# Altium schematic sheet PROB_S7CAS_DDR.SchDoc
size Tabloid; SheetNumber: 10; SheetTotal: 15; Sheet_Name: RAM DDR3 FPGA; Size: 11x17
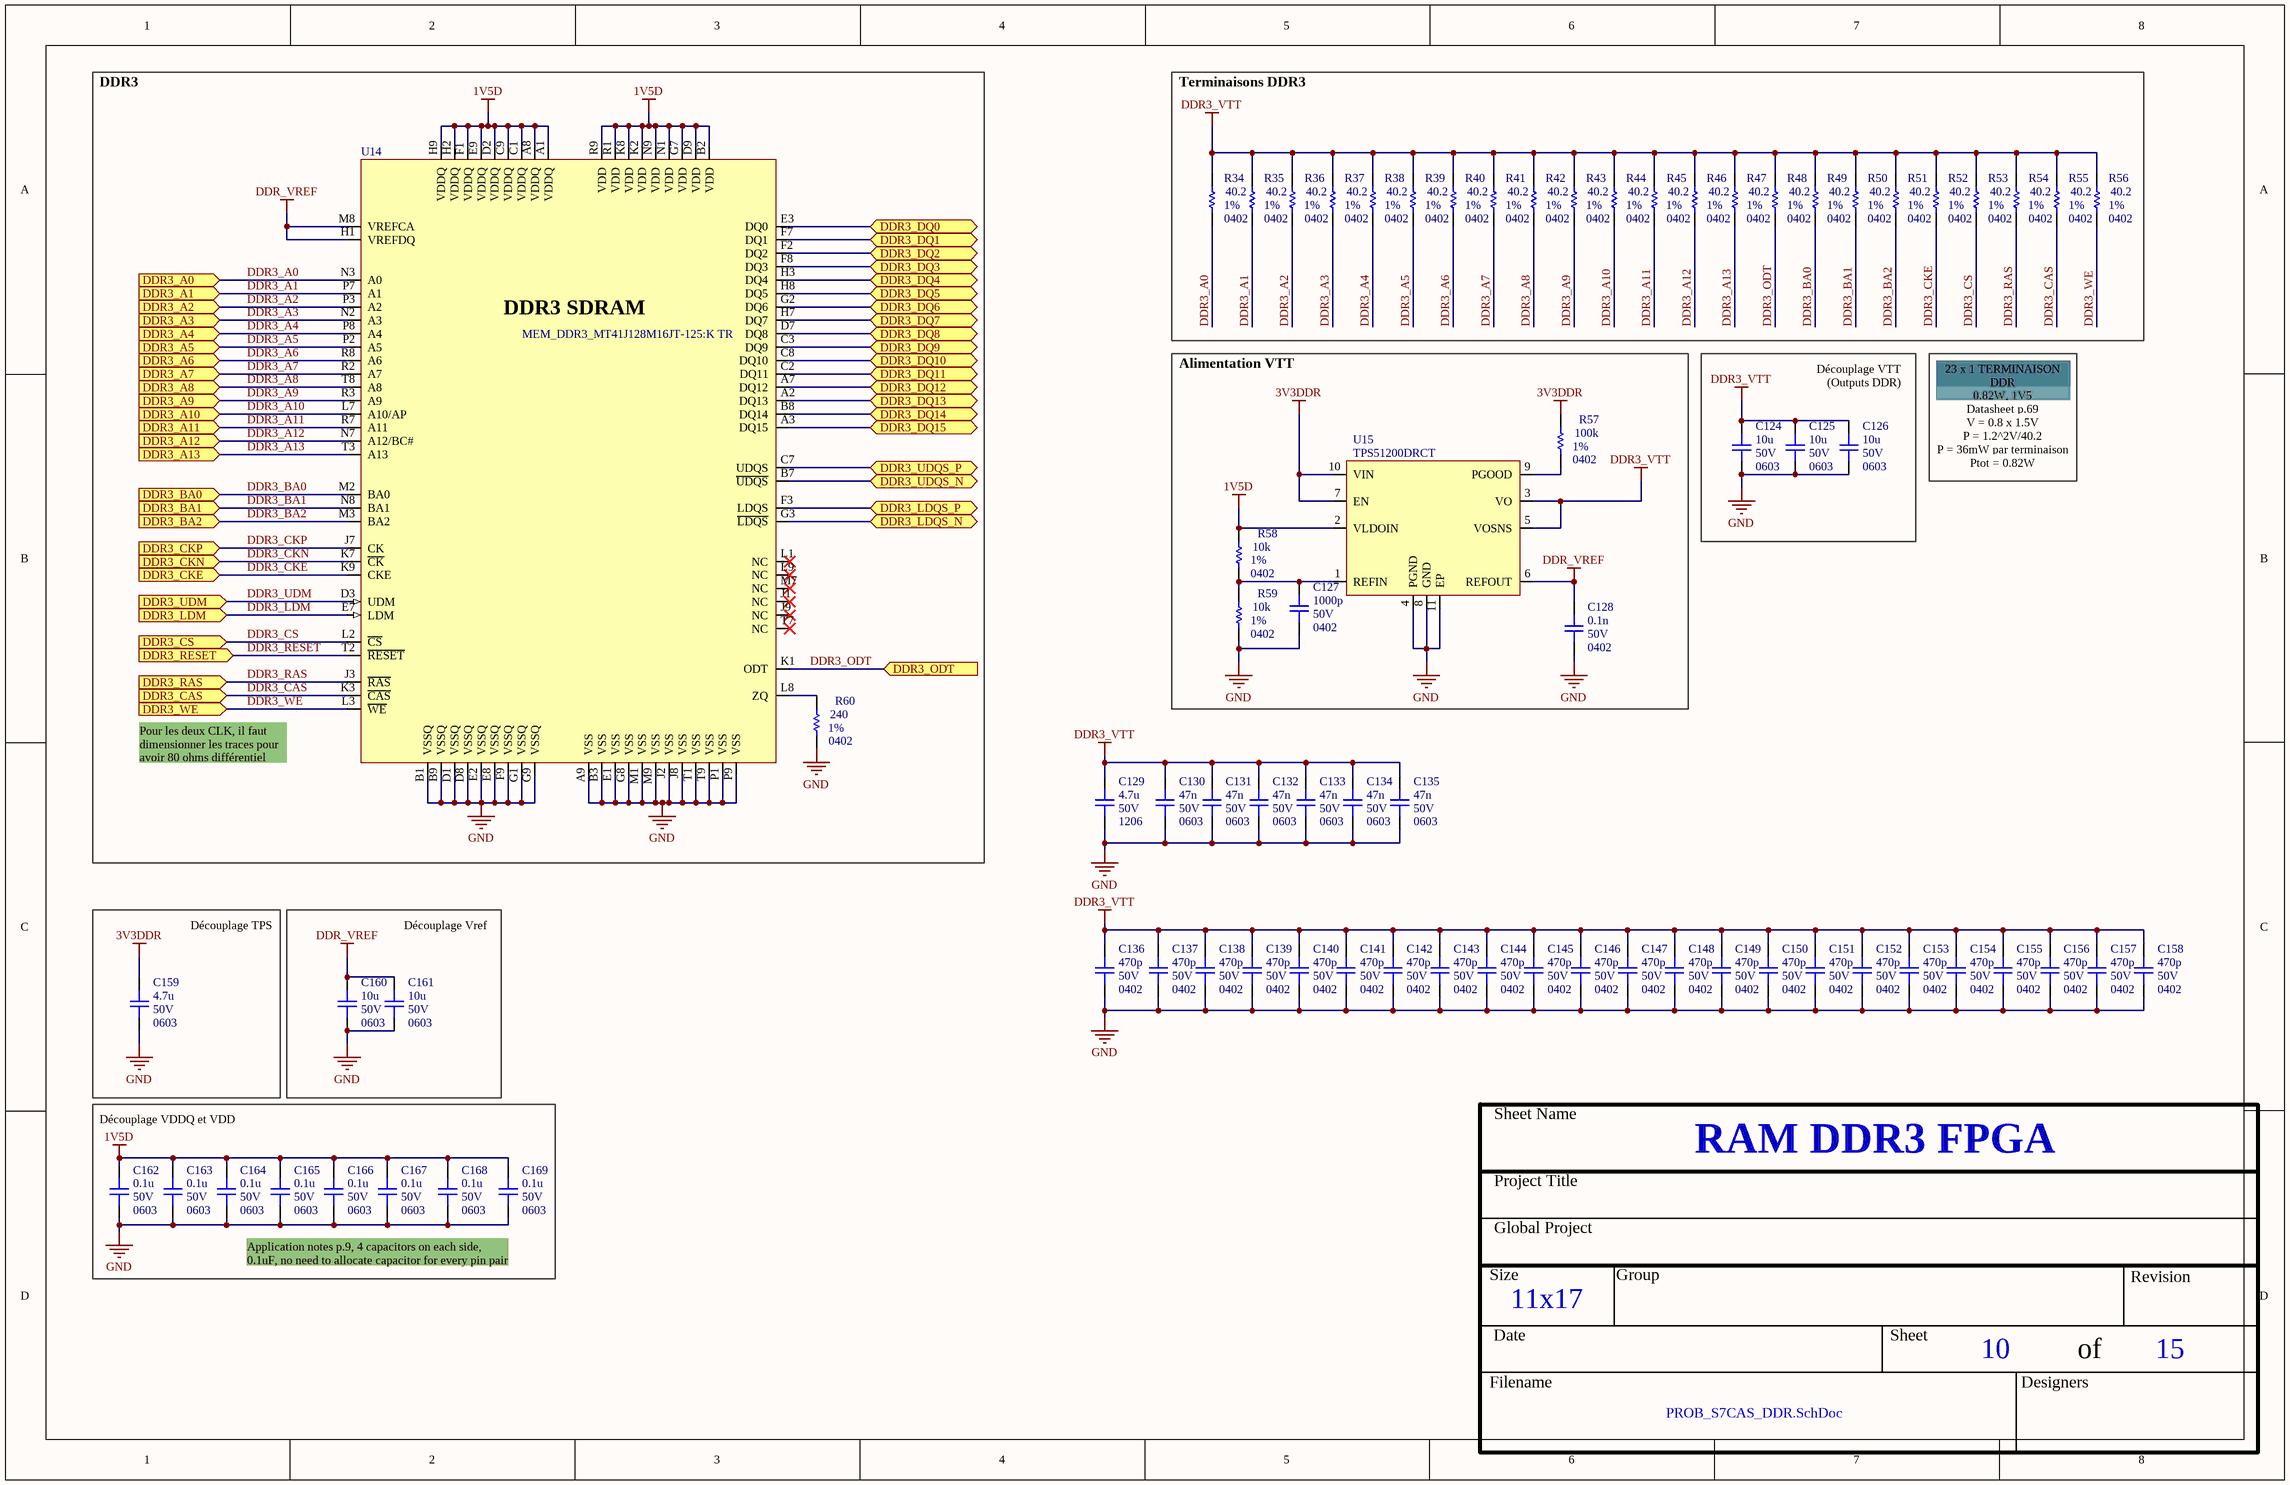
[diagram p0: PROB_S7CAS_DDR.SchDoc]

## Parts
C124  value 10u  Voltage: 50V  Package: 0603  [CAP_0603]  (hidden comment: CAP - 0603)
C125  value 10u  Voltage: 50V  Package: 0603  [CAP_0603]  (hidden comment: CAP - 0603)
C126  value 10u  Voltage: 50V  Package: 0603  [CAP_0603]  (hidden comment: CAP - 0603)
C127  value 1000p  Voltage: 50V  Package: 0402  [CAP_0402]  (hidden comment: CAP - 0402)
C128  value 0.1n  Voltage: 50V  Package: 0402  [CAP_0402]  (hidden comment: CAP - 0402)
C129  value 4.7u  Voltage: 50V  Package: 1206  [CAP_1206]  (hidden comment: CAP - 1206)
C130  value 47n  Voltage: 50V  Package: 0603  [CAP_0603]  (hidden comment: CAP - 0603)
C131  value 47n  Voltage: 50V  Package: 0603  [CAP_0603]  (hidden comment: CAP - 0603)
C132  value 47n  Voltage: 50V  Package: 0603  [CAP_0603]  (hidden comment: CAP - 0603)
C133  value 47n  Voltage: 50V  Package: 0603  [CAP_0603]  (hidden comment: CAP - 0603)
C134  value 47n  Voltage: 50V  Package: 0603  [CAP_0603]  (hidden comment: CAP - 0603)
C135  value 47n  Voltage: 50V  Package: 0603  [CAP_0603]  (hidden comment: CAP - 0603)
C136  value 470p  Voltage: 50V  Package: 0402  [CAP_0402]  (hidden comment: CAP - 0402)
C137  value 470p  Voltage: 50V  Package: 0402  [CAP_0402]  (hidden comment: CAP - 0402)
C138  value 470p  Voltage: 50V  Package: 0402  [CAP_0402]  (hidden comment: CAP - 0402)
C139  value 470p  Voltage: 50V  Package: 0402  [CAP_0402]  (hidden comment: CAP - 0402)
C140  value 470p  Voltage: 50V  Package: 0402  [CAP_0402]  (hidden comment: CAP - 0402)
C141  value 470p  Voltage: 50V  Package: 0402  [CAP_0402]  (hidden comment: CAP - 0402)
C142  value 470p  Voltage: 50V  Package: 0402  [CAP_0402]  (hidden comment: CAP - 0402)
C143  value 470p  Voltage: 50V  Package: 0402  [CAP_0402]  (hidden comment: CAP - 0402)
C144  value 470p  Voltage: 50V  Package: 0402  [CAP_0402]  (hidden comment: CAP - 0402)
C145  value 470p  Voltage: 50V  Package: 0402  [CAP_0402]  (hidden comment: CAP - 0402)
C146  value 470p  Voltage: 50V  Package: 0402  [CAP_0402]  (hidden comment: CAP - 0402)
C147  value 470p  Voltage: 50V  Package: 0402  [CAP_0402]  (hidden comment: CAP - 0402)
C148  value 470p  Voltage: 50V  Package: 0402  [CAP_0402]  (hidden comment: CAP - 0402)
C149  value 470p  Voltage: 50V  Package: 0402  [CAP_0402]  (hidden comment: CAP - 0402)
C150  value 470p  Voltage: 50V  Package: 0402  [CAP_0402]  (hidden comment: CAP - 0402)
C151  value 470p  Voltage: 50V  Package: 0402  [CAP_0402]  (hidden comment: CAP - 0402)
C152  value 470p  Voltage: 50V  Package: 0402  [CAP_0402]  (hidden comment: CAP - 0402)
C153  value 470p  Voltage: 50V  Package: 0402  [CAP_0402]  (hidden comment: CAP - 0402)
C154  value 470p  Voltage: 50V  Package: 0402  [CAP_0402]  (hidden comment: CAP - 0402)
C155  value 470p  Voltage: 50V  Package: 0402  [CAP_0402]  (hidden comment: CAP - 0402)
C156  value 470p  Voltage: 50V  Package: 0402  [CAP_0402]  (hidden comment: CAP - 0402)
C157  value 470p  Voltage: 50V  Package: 0402  [CAP_0402]  (hidden comment: CAP - 0402)
C158  value 470p  Voltage: 50V  Package: 0402  [CAP_0402]  (hidden comment: CAP - 0402)
C159  value 4.7u  Voltage: 50V  Package: 0603  [CAP_0603]  (hidden comment: CAP - 0603)
C160  value 10u  Voltage: 50V  Package: 0603  [CAP_0603]  (hidden comment: CAP - 0603)
C161  value 10u  Voltage: 50V  Package: 0603  [CAP_0603]  (hidden comment: CAP - 0603)
C162  value 0.1u  Voltage: 50V  Package: 0603  [CAP_0603]  (hidden comment: CAP - 0603)
C163  value 0.1u  Voltage: 50V  Package: 0603  [CAP_0603]  (hidden comment: CAP - 0603)
C164  value 0.1u  Voltage: 50V  Package: 0603  [CAP_0603]  (hidden comment: CAP - 0603)
C165  value 0.1u  Voltage: 50V  Package: 0603  [CAP_0603]  (hidden comment: CAP - 0603)
C166  value 0.1u  Voltage: 50V  Package: 0603  [CAP_0603]  (hidden comment: CAP - 0603)
C167  value 0.1u  Voltage: 50V  Package: 0603  [CAP_0603]  (hidden comment: CAP - 0603)
C168  value 0.1u  Voltage: 50V  Package: 0603  [CAP_0603]  (hidden comment: CAP - 0603)
C169  value 0.1u  Voltage: 50V  Package: 0603  [CAP_0603]  (hidden comment: CAP - 0603)
R34  value 40.2  Package: 0402  Precision: 1%  [RES_0402]  (hidden comment: RES - 0402)
R35  value 40.2  Package: 0402  Precision: 1%  [RES_0402]  (hidden comment: RES - 0402)
R36  value 40.2  Package: 0402  Precision: 1%  [RES_0402]  (hidden comment: RES - 0402)
R37  value 40.2  Package: 0402  Precision: 1%  [RES_0402]  (hidden comment: RES - 0402)
R38  value 40.2  Package: 0402  Precision: 1%  [RES_0402]  (hidden comment: RES - 0402)
R39  value 40.2  Package: 0402  Precision: 1%  [RES_0402]  (hidden comment: RES - 0402)
R40  value 40.2  Package: 0402  Precision: 1%  [RES_0402]  (hidden comment: RES - 0402)
R41  value 40.2  Package: 0402  Precision: 1%  [RES_0402]  (hidden comment: RES - 0402)
R42  value 40.2  Package: 0402  Precision: 1%  [RES_0402]  (hidden comment: RES - 0402)
R43  value 40.2  Package: 0402  Precision: 1%  [RES_0402]  (hidden comment: RES - 0402)
R44  value 40.2  Package: 0402  Precision: 1%  [RES_0402]  (hidden comment: RES - 0402)
R45  value 40.2  Package: 0402  Precision: 1%  [RES_0402]  (hidden comment: RES - 0402)
R46  value 40.2  Package: 0402  Precision: 1%  [RES_0402]  (hidden comment: RES - 0402)
R47  value 40.2  Package: 0402  Precision: 1%  [RES_0402]  (hidden comment: RES - 0402)
R48  value 40.2  Package: 0402  Precision: 1%  [RES_0402]  (hidden comment: RES - 0402)
R49  value 40.2  Package: 0402  Precision: 1%  [RES_0402]  (hidden comment: RES - 0402)
R50  value 40.2  Package: 0402  Precision: 1%  [RES_0402]  (hidden comment: RES - 0402)
R51  value 40.2  Package: 0402  Precision: 1%  [RES_0402]  (hidden comment: RES - 0402)
R52  value 40.2  Package: 0402  Precision: 1%  [RES_0402]  (hidden comment: RES - 0402)
R53  value 40.2  Package: 0402  Precision: 1%  [RES_0402]  (hidden comment: RES - 0402)
R54  value 40.2  Package: 0402  Precision: 1%  [RES_0402]  (hidden comment: RES - 0402)
R55  value 40.2  Package: 0402  Precision: 1%  [RES_0402]  (hidden comment: RES - 0402)
R56  value 40.2  Package: 0402  Precision: 1%  [RES_0402]  (hidden comment: RES - 0402)
R57  value 100k  Package: 0402  Precision: 1%  [RES_0402]  (hidden comment: RES - 0402)
R58  value 10k  Package: 0402  Precision: 1%  [RES_0402]  (hidden comment: RES - 0402)
R59  value 10k  Package: 0402  Precision: 1%  [RES_0402]  (hidden comment: RES - 0402)
R60  value 240  Package: 0402  Precision: 1%  [RES_0402]  (hidden comment: RES - 0402)
U14  MEM_DDR3_MT41J128M16JT-125:K TR  [MEM_DDR3_MT41J128M16JT-125]
U15  TPS51200DRCT  [REG_PMIC_TPS51200DRCT]

## Ports
DDR3_A0 (in), DDR3_A1 (in), DDR3_A2 (in), DDR3_A3 (in), DDR3_A4 (in), DDR3_A5 (in), DDR3_A6 (in), DDR3_A7 (in), DDR3_A8 (in), DDR3_A9 (in), DDR3_A10 (in), DDR3_A11 (in), DDR3_A12 (in), DDR3_A13 (in), DDR3_BA0 (in), DDR3_BA1 (in), DDR3_BA2 (in), DDR3_CAS (in), DDR3_CKE (in), DDR3_CKN (in), DDR3_CKP (in), DDR3_CS (in), DDR3_DQ0 (bidir), DDR3_DQ1 (bidir), DDR3_DQ2 (bidir), DDR3_DQ3 (bidir), DDR3_DQ4 (bidir), DDR3_DQ5 (bidir), DDR3_DQ6 (bidir), DDR3_DQ7 (bidir), DDR3_DQ8 (bidir), DDR3_DQ9 (bidir), DDR3_DQ10 (bidir), DDR3_DQ11 (bidir), DDR3_DQ12 (bidir), DDR3_DQ13 (bidir), DDR3_DQ14 (bidir), DDR3_DQ15 (bidir), DDR3_LDM (in), DDR3_LDQS_N (bidir), DDR3_LDQS_P (bidir), DDR3_ODT (in), DDR3_RAS (in), DDR3_RESET (in), DDR3_UDM (in), DDR3_UDQS_N (bidir), DDR3_UDQS_P (bidir), DDR3_WE (in)

## Nets
1V5D: C162.2 C163.2 C164.2 C165.2 C166.2 C167.2 C168.2 C169.2 R58.2 U14.A1(VDDQ) U14.A8(VDDQ) U14.B2(VDD) U14.C1(VDDQ) U14.C9(VDDQ) U14.D2(VDDQ) U14.D9(VDD) U14.E9(VDDQ) U14.F1(VDDQ) U14.G7(VDD) U14.H2(VDDQ) U14.H9(VDDQ) U14.K2(VDD) U14.K8(VDD) U14.N1(VDD) U14.N9(VDD) U14.R1(VDD) U14.R9(VDD) U15.2(VLDOIN)
3V3DDR: C159.2 R57.2 U15.7(EN) U15.10(VIN)
DDR3_VTT: C124.2 C125.2 C126.2 C129.2 C130.2 C131.2 C132.2 C133.2 C134.2 C135.2 C136.2 C137.2 C138.2 C139.2 C140.2 C141.2 C142.2 C143.2 C144.2 C145.2 C146.2 C147.2 C148.2 C149.2 C150.2 C151.2 C152.2 C153.2 C154.2 C155.2 C156.2 C157.2 C158.2 R34.2 R35.2 R36.2 R37.2 R38.2 R39.2 R40.2 R41.2 R42.2 R43.2 R44.2 R45.2 R46.2 R47.2 R48.2 R49.2 R50.2 R51.2 R52.2 R53.2 R54.2 R55.2 R56.2 U15.3(VO) U15.5(VOSNS)
DDR_VREF: C128.2 C160.2 C161.2 U14.H1(VREFDQ) U14.M8(VREFCA) U15.6(REFOUT)
GND: C124.1 C125.1 C126.1 C127.1 C128.1 C129.1 C130.1 C131.1 C132.1 C133.1 C134.1 C135.1 C136.1 C137.1 C138.1 C139.1 C140.1 C141.1 C142.1 C143.1 C144.1 C145.1 C146.1 C147.1 C148.1 C149.1 C150.1 C151.1 C152.1 C153.1 C154.1 C155.1 C156.1 C157.1 C158.1 C159.1 C160.1 C161.1 C162.1 C163.1 C164.1 C165.1 C166.1 C167.1 C168.1 C169.1 R59.1 R60.1 U14.A9(VSS) U14.B1(VSSQ) U14.B3(VSS) U14.B9(VSSQ) U14.D1(VSSQ) U14.D8(VSSQ) U14.E1(VSS) U14.E2(VSSQ) U14.E8(VSSQ) U14.F9(VSSQ) U14.G1(VSSQ) U14.G8(VSS) U14.G9(VSSQ) U14.J2(VSS) U14.J8(VSS) U14.M1(VSS) U14.M9(VSS) U14.P1(VSS) U14.P9(VSS) U14.T1(VSS) U14.T9(VSS) U15.4(PGND) U15.8(GND) U15.11(EP)
DDR3_A0: R34.1 U14.N3(A0) ; port DDR3_A0
DDR3_A1: R35.1 U14.P7(A1) ; port DDR3_A1
DDR3_A2: R36.1 U14.P3(A2) ; port DDR3_A2
DDR3_A3: R37.1 U14.N2(A3) ; port DDR3_A3
DDR3_A4: R38.1 U14.P8(A4) ; port DDR3_A4
DDR3_A5: R39.1 U14.P2(A5) ; port DDR3_A5
DDR3_A6: R40.1 U14.R8(A6) ; port DDR3_A6
DDR3_A7: R41.1 U14.R2(A7) ; port DDR3_A7
DDR3_A8: R42.1 U14.T8(A8) ; port DDR3_A8
DDR3_A9: R43.1 U14.R3(A9) ; port DDR3_A9
DDR3_A10: R44.1 U14.L7(A10/AP) ; port DDR3_A10
DDR3_A11: R45.1 U14.R7(A11) ; port DDR3_A11
DDR3_A12: R46.1 U14.N7(A12/BC#) ; port DDR3_A12
DDR3_A13: R47.1 U14.T3(A13) ; port DDR3_A13
DDR3_BA0: R49.1 U14.M2(BA0) ; port DDR3_BA0
DDR3_BA1: R50.1 U14.N8(BA1) ; port DDR3_BA1
DDR3_BA2: R51.1 U14.M3(BA2) ; port DDR3_BA2
DDR3_CAS: R55.1 U14.K3(~{CAS}) ; port DDR3_CAS
DDR3_CKE: R52.1 U14.K9(CKE) ; port DDR3_CKE
DDR3_CKN: U14.K7(~{CK}) ; port DDR3_CKN
DDR3_CKP: U14.J7(CK) ; port DDR3_CKP
DDR3_CS: R53.1 U14.L2(~{CS}) ; port DDR3_CS
DDR3_DQ0: U14.E3(DQ0) ; port DDR3_DQ0
DDR3_DQ1: U14.F7(DQ1) ; port DDR3_DQ1
DDR3_DQ2: U14.F2(DQ2) ; port DDR3_DQ2
DDR3_DQ3: U14.F8(DQ3) ; port DDR3_DQ3
DDR3_DQ4: U14.H3(DQ4) ; port DDR3_DQ4
DDR3_DQ5: U14.H8(DQ5) ; port DDR3_DQ5
DDR3_DQ6: U14.G2(DQ6) ; port DDR3_DQ6
DDR3_DQ7: U14.H7(DQ7) ; port DDR3_DQ7
DDR3_DQ8: U14.D7(DQ8) ; port DDR3_DQ8
DDR3_DQ9: U14.C3(DQ9) ; port DDR3_DQ9
DDR3_DQ10: U14.C8(DQ10) ; port DDR3_DQ10
DDR3_DQ11: U14.C2(DQ11) ; port DDR3_DQ11
DDR3_DQ12: U14.A7(DQ12) ; port DDR3_DQ12
DDR3_DQ13: U14.A2(DQ13) ; port DDR3_DQ13
DDR3_DQ14: U14.B8(DQ14) ; port DDR3_DQ14
DDR3_DQ15: U14.A3(DQ15) ; port DDR3_DQ15
DDR3_LDM: U14.E7(LDM) ; port DDR3_LDM
DDR3_LDQS_N: U14.G3(~{LDQS}) ; port DDR3_LDQS_N
DDR3_LDQS_P: U14.F3(LDQS) ; port DDR3_LDQS_P
DDR3_ODT: R48.1 U14.K1(ODT) ; port DDR3_ODT
DDR3_RAS: R54.1 U14.J3(~{RAS}) ; port DDR3_RAS
DDR3_RESET: U14.T2(~{RESET}) ; port DDR3_RESET
DDR3_UDM: U14.D3(UDM) ; port DDR3_UDM
DDR3_UDQS_N: U14.B7(~{UDQS}) ; port DDR3_UDQS_N
DDR3_UDQS_P: U14.C7(UDQS) ; port DDR3_UDQS_P
DDR3_WE: R56.1 U14.L3(~{WE}) ; port DDR3_WE
NetC127_2: C127.2 R58.1 R59.2 U15.1(REFIN)
NetR57_1: R57.1 U15.9(PGOOD)
NetR60_2: R60.2 U14.L8(ZQ)

Not connected (* = marked no-connect by the designer): U14 J1(NC)* J9(NC)* L1(NC)* L9(NC)* M7(NC)* T7(NC)*

## Notes on the sheet
- DDR3
- Terminaisons DDR3
- Alimentation VTT
- Découplage VTT (Outputs DDR)
- 23 x 1 TERMINAISON
- DDR
- 0.82W, 1V5
- Datasheet p.69
- V = 0.8 x 1.5V
- P = 1.2^2V/40.2
- P = 36mW par terminaison
- Ptot = 0.82W
- Pour les deux CLK, il faut dimensionner les traces pour avoir 80 ohms différentiel
- Découplage TPS
- Découplage Vref
- Découplage VDDQ et VDD
- Application notes p.9, 4 capacitors on each side, 0.1uF, no need to allocate capacitor for every pin pair
- Sheet Name
- Project Title
- Global Project
- Size
- Group
- Revision
- Date
- Sheet
- of
- Filename
- Designers
- (in symbol MEM_DDR3_MT41J128M16JT-125:K TR) DDR3 SDRAM

## Library data of the parts
C124-C126 C130-C135 C159-C169 = CAP - 0603: Precision: 10%; Current: *; CreatedBy: Jonathan Bouchard; Power: *
C127 C128 C136-C158 = CAP - 0402: Precision: 10%; Current: *; CreatedBy: Jonathan Bouchard; Power: *
C129 = CAP - 1206: Precision: 10%; Current: *; CreatedBy: Jonathan Bouchard; Power: *
R34-R60 = RES - 0402: Voltage: 50V; Power: 1/16W; Current: *; CreatedBy: Jonathan Bouchard
U14 = MEM_DDR3_MT41J128M16JT-125:K TR: MEM - DDR3 SDRAM 2GBIT 800MHZ - TFBGA-96; Voltage: 1.425 V ~ 1.575 V; Mfg: Micrel; Current: *; Package: TFBGA-96; Precision: *; Mfg Part Number: http://www.micron.com/~/media/Documents/Products/Data%20Sheet/DRAM/DDR3/2Gb_DDR3_SDRAM.pdf; Temperature: 0°C ~ 95°C (TC); Power: *; HelpURL: http://ww1.microchip.com/downloads/en/DeviceDoc/00002275A.pdf; CreatedBy: Jonathan Bouchard; Value: *; Supplier 1: Digikey; Supplier Part Number 1: 557-1611-1-ND
U15 = REG_PMIC_TPS51200DRCT: REG - DDR TERMINATION/REF REG - 10-VFDFN; Manufacturer #1: Texas Instruments; Value: DDR, DDR2, DDR3(L), DDR4; Voltage Rating: 2.375V ~ 3.5V; Current Rating: Source: 3A~4.5A, Sink: 3.5A~5.5A; GRAMS Lib Spec: 2.8; Magnetic Material: Unknown; Polarized: Yes; Tolerance: *; Power Max: *; HelpURL: http://www.ti.com/lit/ds/symlink/tps51200.pdf; CreatedBy/Date: Joel Lemay 2019-03-19; VerifiedBy: Nicolas V. (2019-05-31); Temperature: -40°C ~ 85°C; Package: 10-VFDFN; Manufacturer #2: *; Note: *; Assembly Type: SMD; Part Number #2: *; Part Number #1: TPS51200DRCT; Supplier 1: Digi-Key; Supplier Part Number 1: 296-23830-1-ND; Cryo: UNKNOWN